# Altium schematic sheet MICROSD.SchDoc
size D; SheetNumber: 3; SheetTotal: 6
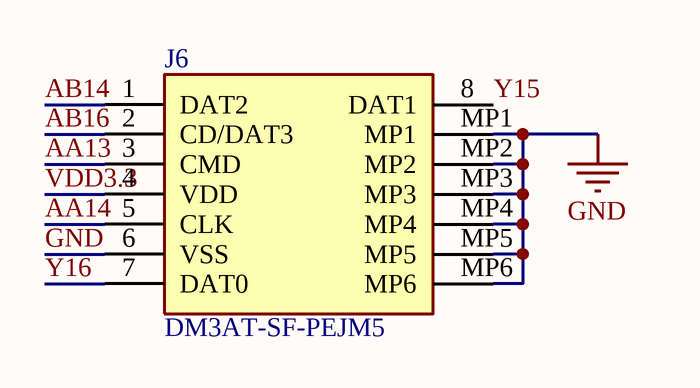
[diagram p0: MICROSD.SchDoc]

## Parts
J6  DM3AT-SF-PEJM5  [DM3ATSFPEJM5]

## Nets
GND: J6.6(VSS) J6.MP1 J6.MP2 J6.MP3 J6.MP4 J6.MP5 J6.MP6
AA13: J6.3(CMD)
AA14: J6.5(CLK)
AB14: J6.1(DAT2)
AB16: J6.2(CD/DAT3)
VDD3.3: J6.4(VDD)
Y15: J6.8(DAT1)
Y16: J6.7(DAT0)

## Library data of the parts
J6 = DM3AT-SF-PEJM5: Connector; Manufacturer_Name: Hirose; Datasheet Link: https://datasheet.lcsc.com/szlcsc/Hirose-HRS-DM3AT-SF-PEJM5_C114218.pdf; Height: 1.83mm; Manufacturer_Part_Number: DM3AT-SF-PEJM5; Mouser Part Number: 798-DM3AT-SF-PEJM5; Mouser Price/Stock: https://www.mouser.co.uk/ProductDetail/Hirose-Connector/DM3AT-SF-PEJM5?qs=LZSZKJVF%252B2WTDKp%252BR7IYAQ%3D%3D